# EAGLE design dsPIC_I2CMini (EAGLE 7.2.0)
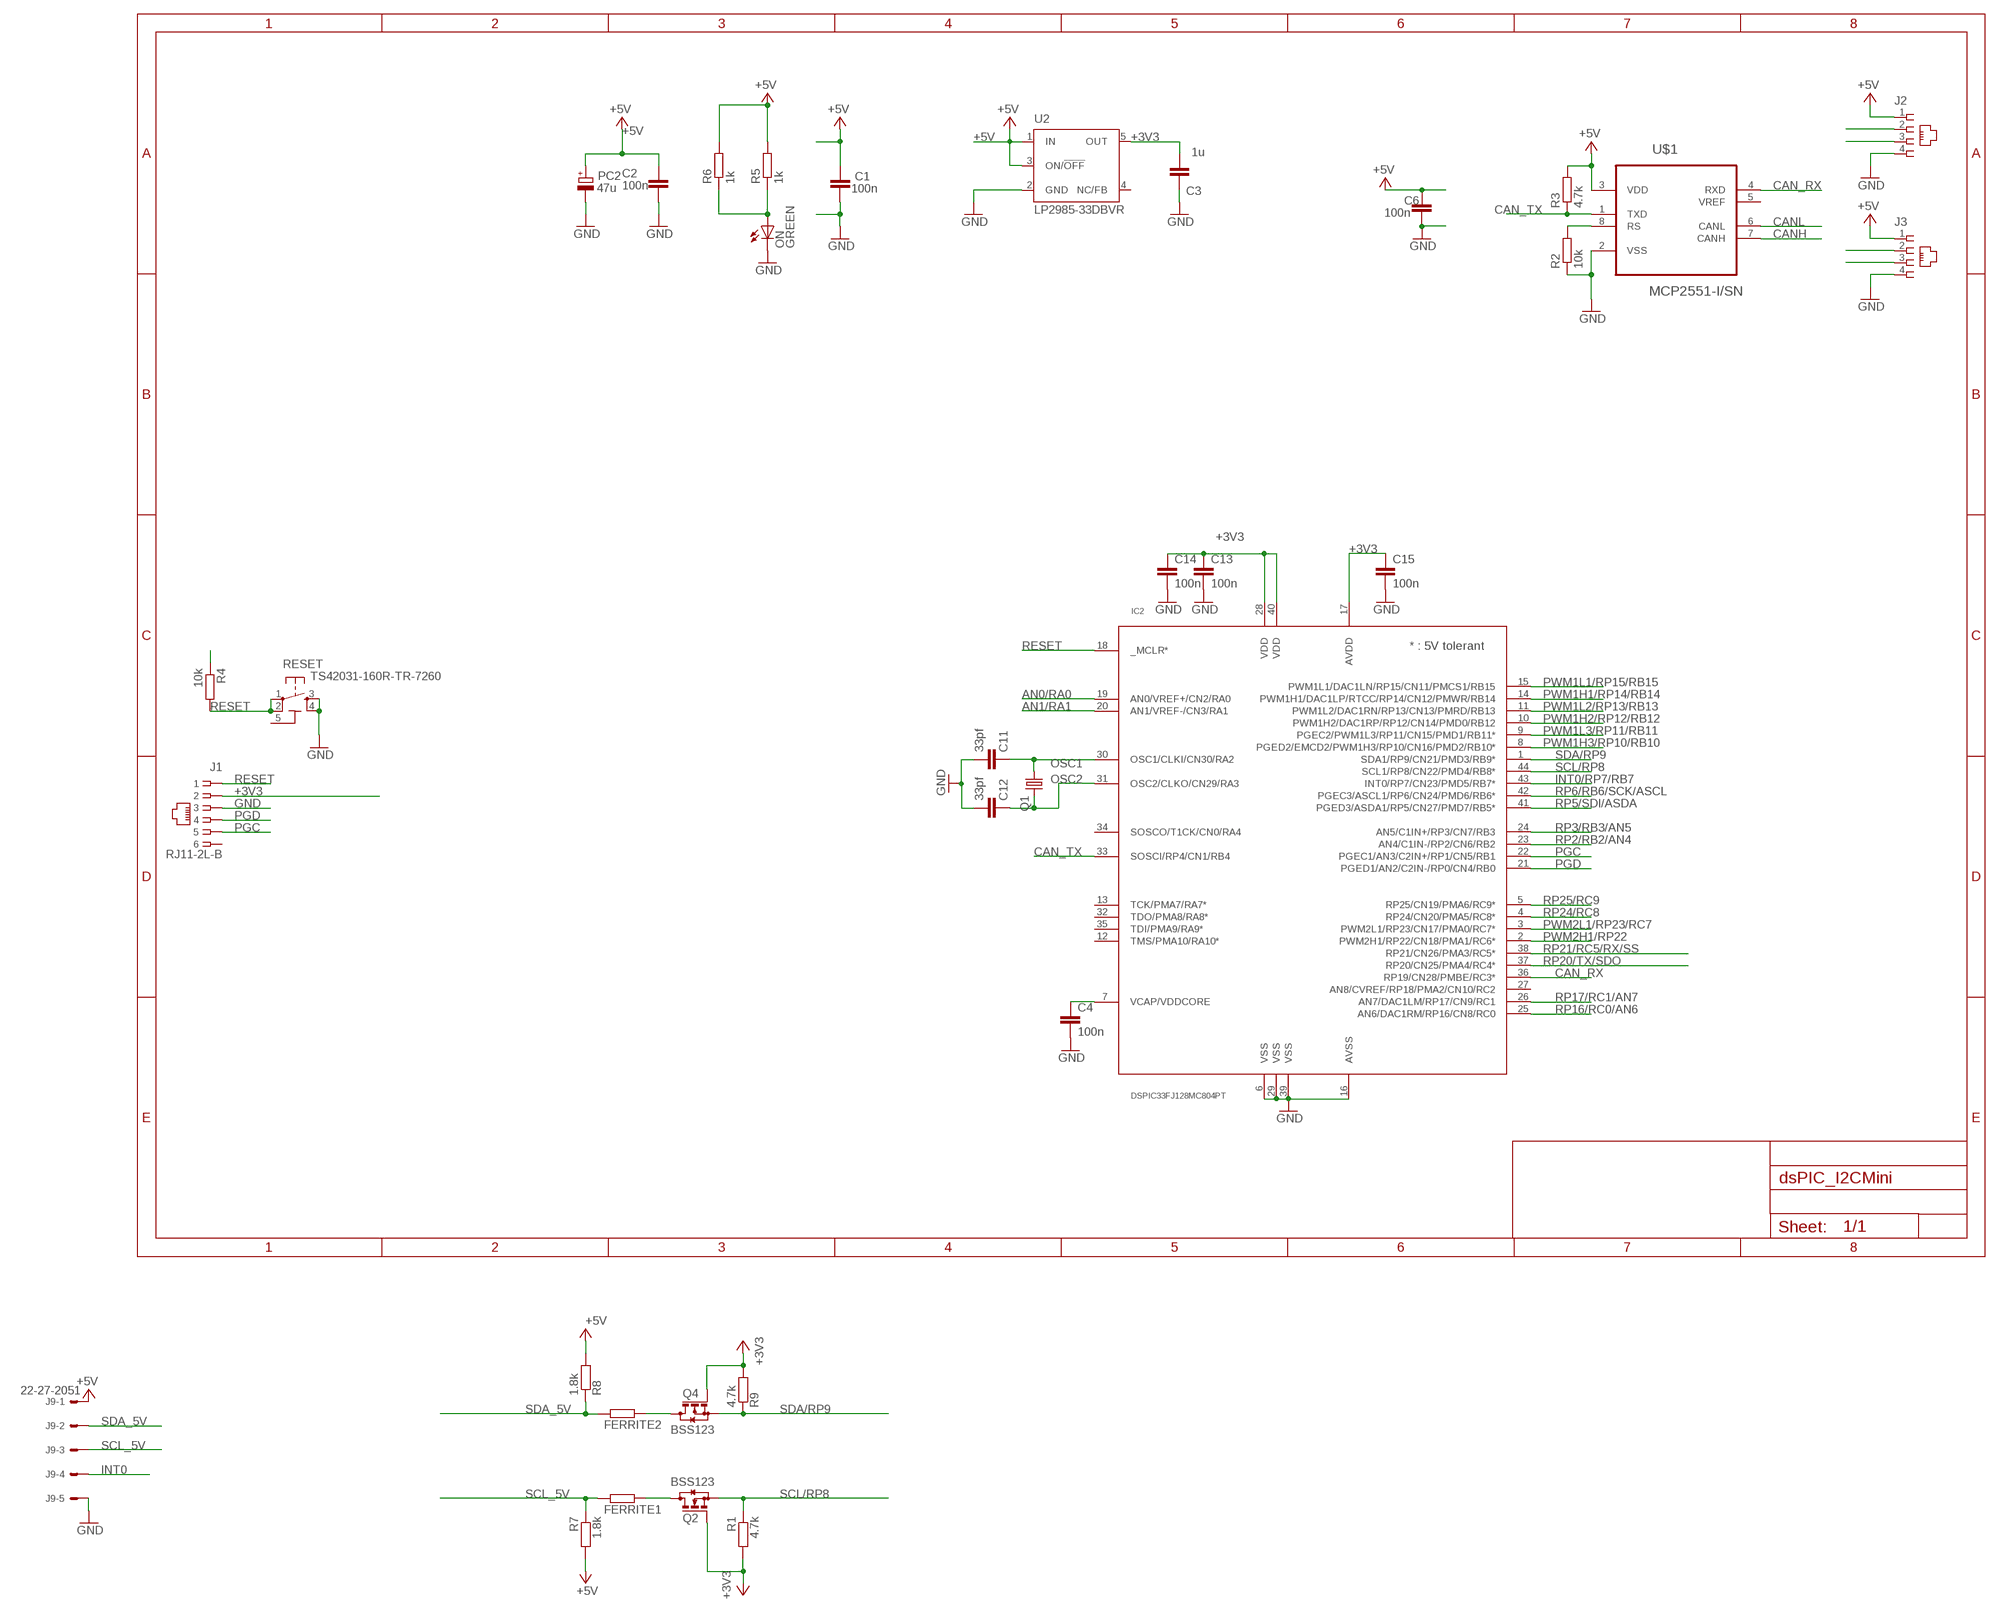
[diagram p0: schematic, sheet 1]

## Parts
C1  100n  C-EU0603-RND  [C0603-ROUND]
C2  100n  C-EU0603-RND  [C0603-ROUND]
C3  1u  C-EU0603-RND  [C0603-ROUND]
C4  100n  C-EUC0603K  [C0603K]
C6  100n  C-EUC0603K  [C0603K]
C11  33pf  C-EUC0603  [C0603]
C12  33pf  C-EUC0603  [C0603]
C13  100n  C-EUC0603  [C0603]
C14  100n  C-EUC0603  [C0603]
C15  100n  C-EUC0603  [C0603]
FERRITE1  R-EU_M0805  [M0805]
FERRITE2  R-EU_M0805  [M0805]
IC2  DSPIC33FJ128MC804PT  [TQFP44]
J1  RJ11-2L-B  [RJ11-NO_SHIELD]
J2  520249-2  [520249-2]
J3  520249-2  [520249-2]
J9  22-27-2051  22-27-2051-05  [6410-05]
ON  GREEN  LEDCHIP-LED0805  [CHIP-LED0805]
PC2  47u  CPOL-EUD  [PANASONIC_D]
Q1  CRYSTALSM49  [SM49]
Q2  BSS123  [SOT23]
Q4  BSS123  [SOT23]
R1  4.7k  R-EU_R0805  [R0805]
R2  10k  R-EU_R0805  [R0805]
R3  4.7k  R-EU_R0805  [R0805]
R4  10k  R-EU_R0805  [R0805]
R5  1k  R-EU_R0805  [R0805]
R6  1k  R-EU_R0805  [R0805]
R7  1.8k  R-EU_R0805  [R0805]
R8  1.8k  R-EU_R0805  [R0805]
R9  4.7k  R-EU_R0805  [R0805]
RESET  TS42031-160R-TR-7260  TS42  [TS42]
U2  LP2985-33DBVR  LP2985-XXDBVR33  [SOT23-DBV]
U$1  MCP2551-I/SN  [SOIC127P600X175-8N]

## Nets
+3V3: C3.2 C13.1 C14.1 C15.1 IC2.17(AVDD) IC2.28(VDD) IC2.40(VDD) J1.2 Q2.1(G) Q4.1(G) R1.2 R4.1 R9.2 U2.5(OUT)
+5V: C1.2 C2.2 C6.2 J2.1 J3.1 J9.1 PC2.+ R3.2 R5.2 R6.2 R7.2 R8.2 U2.1(IN) U2.3(ON/!OFF) U$1.3(VDD)
AN0/RA0: IC2.19(AN0/VREF+/CN2/RA0)
AN1/RA1: IC2.20(AN1/VREF-/CN3/RA1)
ASCL: FERRITE1.2 Q2.3(D)
ASDA: FERRITE2.2 Q4.3(D)
CAN_RX: IC2.36(RP19/CN28/PMBE/RC3*) U$1.4(RXD)
CAN_TX: IC2.33(SOSCI/RP4/CN1/RB4) R3.1 U$1.1(TXD)
CANH: J2.2 J3.2 U$1.7(CANH)
CANL: J2.3 J3.3 U$1.6(CANL)
GND: C1.1 C2.1 C3.1 C4.2 C6.1 C11.2 C12.2 C13.2 C14.2 C15.2 IC2.6(VSS) IC2.16(AVSS) IC2.29(VSS) IC2.39(VSS) J1.3 J2.4 J3.4 J9.5 ON.C PC2.- R2.1 RESET.3 RESET.4 U2.2(GND) U$1.2(VSS)
INT0: J9.4
INT0/RP7/RB7: IC2.43(INT0/RP7/CN23/PMD5/RB7*)
N$3: ON.A R5.1 R6.1
N$5: C4.1 IC2.7(VCAP/VDDCORE)
N$11: R2.2 U$1.8(RS)
OSC1: C11.1 IC2.30(OSC1/CLKI/CN30/RA2) Q1.1
OSC2: C12.1 IC2.31(OSC2/CLKO/CN29/RA3) Q1.2
PGC: IC2.22(PGEC1/AN3/C2IN+/RP1/CN5/RB1) J1.5
PGD: IC2.21(PGED1/AN2/C2IN-/RP0/CN4/RB0) J1.4
PWM1H1/RP14/RB14: IC2.14(PWM1H1/DAC1LP/RTCC/RP14/CN12/PMWR/RB14)
PWM1H2/RP12/RB12: IC2.10(PWM1H2/DAC1RP/RP12/CN14/PMD0/RB12)
PWM1H3/RP10/RB10: IC2.8(PGED2/EMCD2/PWM1H3/RP10/CN16/PMD2/RB10*)
PWM1L1/RP15/RB15: IC2.15(PWM1L1/DAC1LN/RP15/CN11/PMCS1/RB15)
PWM1L2/RP13/RB13: IC2.11(PWM1L2/DAC1RN/RP13/CN13/PMRD/RB13)
PWM1L3/RP11/RB11: IC2.9(PGEC2/PWM1L3/RP11/CN15/PMD1/RB11*)
PWM2H1/RP22: IC2.2(PWM2H1/RP22/CN18/PMA1/RC6*)
PWM2L1/RP23/RC7: IC2.3(PWM2L1/RP23/CN17/PMA0/RC7*)
RESET: IC2.18(_MCLR*) J1.1 R4.2 RESET.1 RESET.2
RP2/RB2/AN4: IC2.23(AN4/C1IN-/RP2/CN6/RB2)
RP3/RB3/AN5: IC2.24(AN5/C1IN+/RP3/CN7/RB3)
RP5/SDI/ASDA: IC2.41(PGED3/ASDA1/RP5/CN27/PMD7/RB5*)
RP6/RB6/SCK/ASCL: IC2.42(PGEC3/ASCL1/RP6/CN24/PMD6/RB6*)
RP16/RC0/AN6: IC2.25(AN6/DAC1RM/RP16/CN8/RC0)
RP17/RC1/AN7: IC2.26(AN7/DAC1LM/RP17/CN9/RC1)
RP20/TX/SDO: IC2.37(RP20/CN25/PMA4/RC4*)
RP21/RC5/RX/SS: IC2.38(RP21/CN26/PMA3/RC5*)
RP24/RC8: IC2.4(RP24/CN20/PMA5/RC8*)
RP25/RC9: IC2.5(RP25/CN19/PMA6/RC9*)
SCL/RP8: IC2.44(SCL1/RP8/CN22/PMD4/RB8*) Q2.2(S) R1.1
SCL_5V: FERRITE1.1 J9.3 R7.1
SDA/RP9: IC2.1(SDA1/RP9/CN21/PMD3/RB9*) Q4.2(S) R9.1
SDA_5V: FERRITE2.1 J9.2 R8.1
Unconnected: IC2.12(TMS/PMA10/RA10*) IC2.13(TCK/PMA7/RA7*) IC2.27(AN8/CVREF/RP18/PMA2/CN10/RC2) IC2.32(TDO/PMA8/RA8*) IC2.34(SOSCO/T1CK/CN0/RA4) IC2.35(TDI/PMA9/RA9*) J1.6 U2.4(NC/FB) U$1.5(VREF)

## Power pins joined to a net without a drawn wire
5-GND: RESET.5(5-GND)

## Library data of the parts
C1 C2 C4 C6 = SmartPrj:C-EU: CAPACITOR, European symbol; OC_FARNELL: 2210925
C3 = SmartPrj:C-EU: CAPACITOR, European symbol; OC_FARNELL: 2346901
C11 C12 = LibPerso:C-EU: CAPACITOR, European symbol; OC_FARNELL: 1740598
C13-C15 = LibPerso:C-EU: CAPACITOR, European symbol; OC_FARNELL: 2210925
FERRITE1 FERRITE2 = LibPerso:R-EU_: RESISTOR, European symbol; OC_FARNELL: 2292459
IC2 = microchip-dspic33:DSPIC33F*04
J1 = LibPerso:RJ11: CORCOM Modular RJ Jacks No Shield Source: www.tycoelectronics.com .. ENG_DS_1654001_1099_RJ_L_0507.pdf; MF: TYCO ELECTRONICS; MPN: RJ11-2L-B; OC_FARNELL: 1393306; OC_NEWARK: 83F4463
J2 J3 = LibPerso:520249-2: AMP connector; OC_FARNELL: 1137972; OC_RS: 477-359
J9 = con-molex:22-?-05: CONNECTOR wire to board 2.54 mm (.1 inch) pitch header; OC_FARNELL: unknown; OC_NEWARK: unknown
ON = led:LED: LED OSRAM: - CHIPLED LG R971, LG N971, LY N971, LG Q971, LY Q971, LO R971, LY R971 LH N974, LH R974 LS Q976, LO Q976, LY Q976 LO Q996 - Hyper CHIPLED LW Q18S LB Q993, LB Q99A, LB R99A - SideLED LS A670, LO A670, LY A670, LG A670, LP A670 LB A673, LV A673, LT A673, LW A673 LH A674 LY A675 LS A676, LA A676, LO A676, LY A676, LW A676 LS A679, LY A679, LG A679 - Hyper Micro SIDELED® LS Y876, LA Y876, LO Y876, LY Y876 LT Y87S - SmartLED LW L88C, LW L88S LB L89C, LB L89S, LG L890 LS L89K, LO L89K, LY L89K LS L896, LA L896, LO L896, LY L896 - TOPLED LS T670, LO T670, LY T670, LG T670, LP T670 LSG T670, LSP T670, LSY T670, LOP T670, LYG T670 LG T671, LOG T671, LSG T671 LB T673, LV T673, LT T673, LW T673 LH T674 LS T676, LA T676, LO T676, LY T676, LB T676, LH T676, LSB T676, LW T676 LB T67C, LV T67C, LT T67C, LS T67K, LO T67K, LY T67K, LW E67C LS E67B, LA E67B, LO E67B, LY E67B, LB E67C, LV E67C, LT E67C LW T67C LS T679, LY T679, LG T679 LS T770, LO T770, LY T770, LG T770, LP T770 LB T773, LV T773, LT T773, LW T773 LH T774 LS E675, LA E675, LY E675, LS T675 LS T776, LA T776, LO T776, LY T776, LB T776 LHGB T686 LT T68C, LB T68C - Hyper Mini TOPLED® LB M676 - Mini TOPLED Santana® LG M470 LS M47K, LO M47K, LY M47K Source: http://www.osram.convergy.de LUXEON: - LUMILED® LXK2-PW12-R00, LXK2-PW12-S00, LXK2-PW14-U00, LXK2-PW14-V00 LXK2-PM12-R00, LXK2-PM12-S00, LXK2-PM14-U00 LXK2-PE12-Q00, LXK2-PE12-R00, LXK2-PE12-S00, LXK2-PE14-T00, LXK2-PE14-U00 LXK2-PB12-K00, LXK2-PB12-L00, LXK2-PB12-M00, LXK2-PB14-N00, LXK2-PB14-P00, LXK2-PB14-Q00 LXK2-PR12-L00, LXK2-PR12-M00, LXK2-PR14-Q00, LXK2-PR14-R00 LXK2-PD12-Q00, LXK2-PD12-R00, LXK2-PD12-S00 LXK2-PH12-R00, LXK2-PH12-S00 LXK2-PL12-P00, LXK2-PL12-Q00, LXK2-PL12-R00 Source: www.luxeon.com KINGBRIGHT: KA-3528ASYC Source: www.kingbright.com; OC_FARNELL: 8529906
PC2 = rcl:CPOL-EU: POLARIZED CAPACITOR, European symbol; OC_FARNELL: 1850100
Q1 = crystal:CRYSTAL: CRYSTAL; OC_FARNELL: 1842332; OC_NEWARK: unknown
Q2 Q4 = transistor-small-signal:BSS123: N-CHANNEL MOS FET
R1 R7-R9 = rcl:R-EU_: RESISTOR, European symbol
R2-R6 = LibPerso:R-EU_: RESISTOR, European symbol
RESET = SmartPrj:TS42: TS42 Dongnan Electronics Tact switch VDC 12V - 50mA; OC_FARNELL: 2060823
U2 = SmartPrj:LP2985-XXDBVR: ULTRALOW-POWER 50-mA LOW-DROPOUT LINEAR REGULATORS 50-mA Low-Dropout Regulator Source: http://focus.ti.com/lit/ds/symlink/tps77001.pdf; OC_FARNELL: 2395925
U$1 = LibPerso:MCP2551-I/SN: High-Speed CAN Transceiver; MPN: MCP2551-I/SN; OC_FARNELL: 9758569; OC_NEWARK: 69K7604; PACKAGE: SOIC-8; SUPPLIER: Microchip

## Net classes
0 default: width 0.254 mm, clearance 0.254 mm
1 power: width 0.61 mm, drill 0.61 mm, clearance 0.254 mm
2 gnd: width 0.305 mm, drill 0.559 mm, clearance 0.254 mm
3 usbvcc: width 0.508 mm, drill 0.61 mm, clearance 0.254 mm
4 aref: width 0.406 mm, drill 0.61 mm, clearance 0.254 mm

## Board
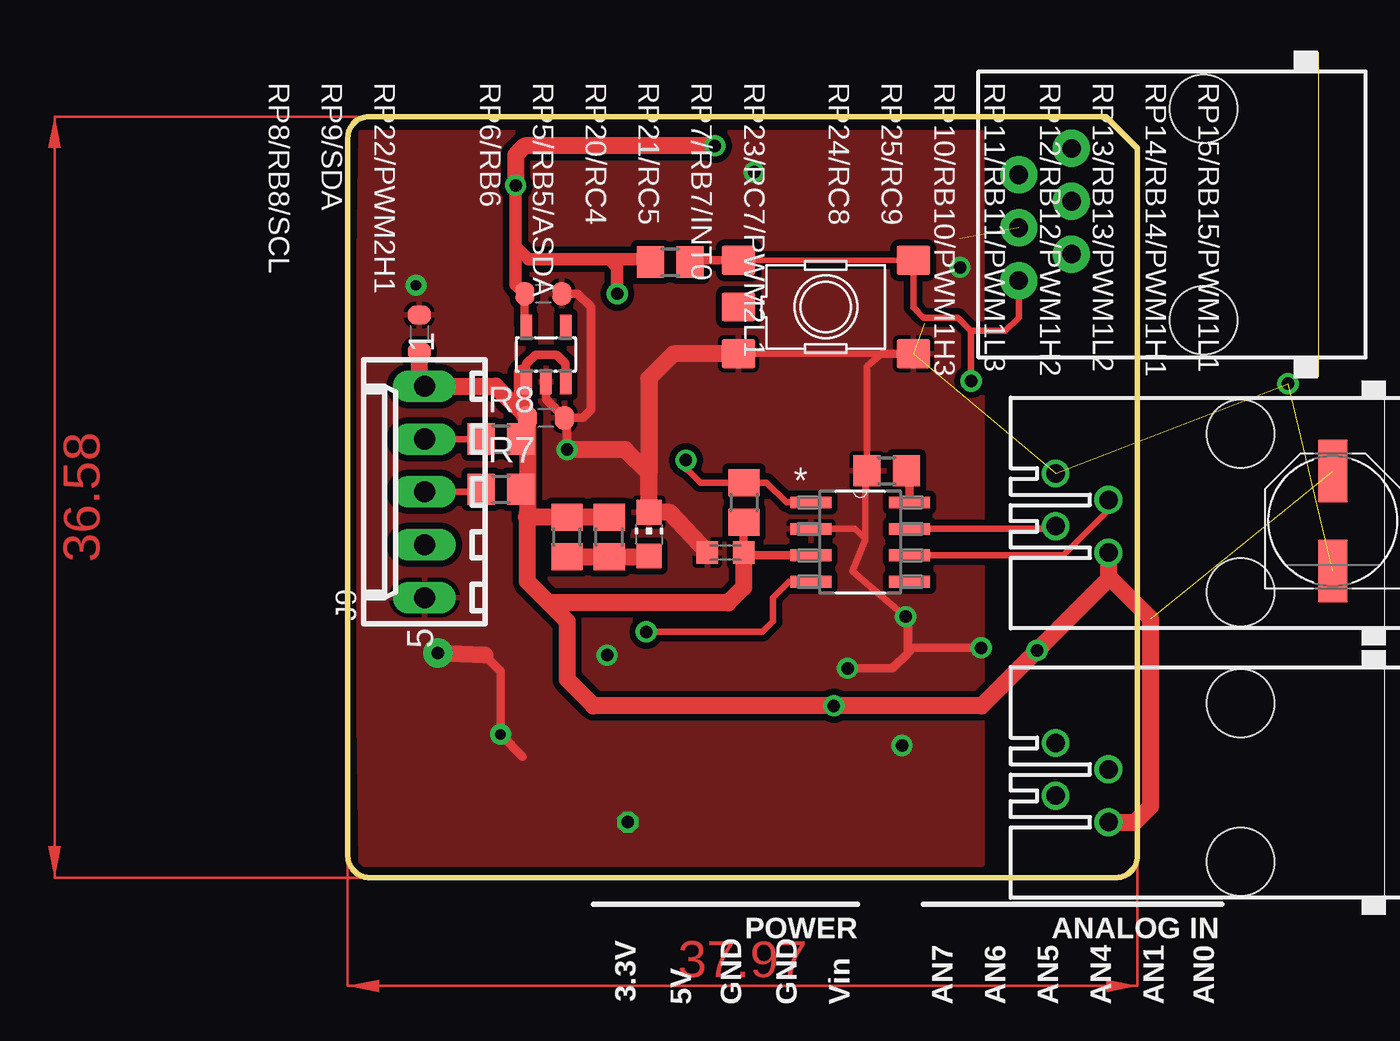
[diagram p1: board, top side]
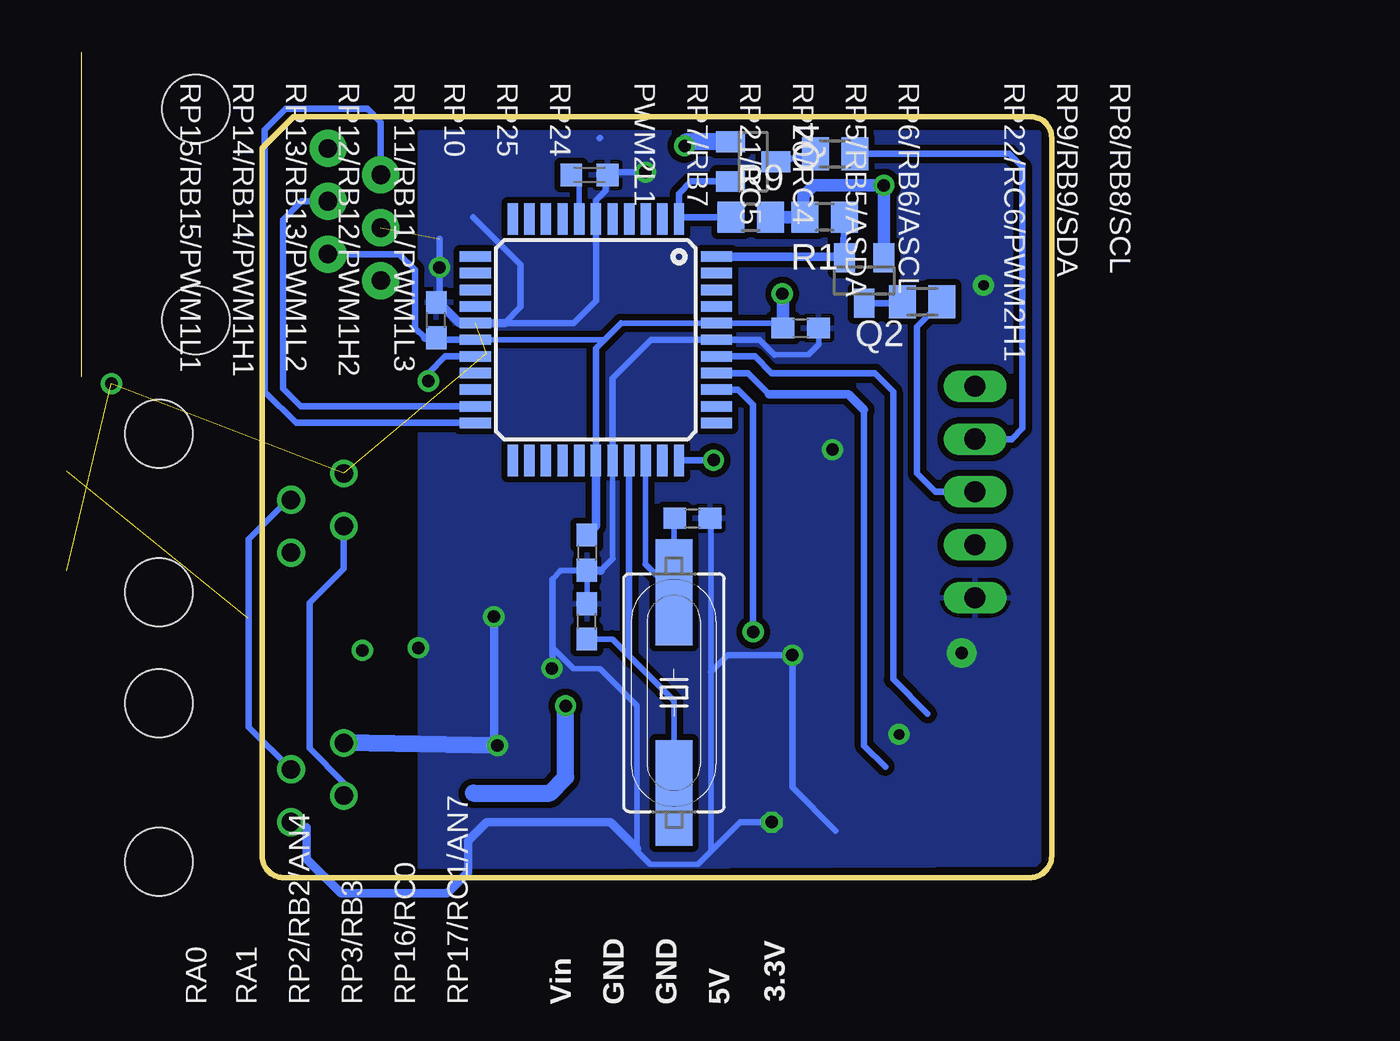
[diagram p2: board, bottom side, seen from below]

Size 37.98 x 36.58 mm. Coordinates in mm from the lower left corner, seen from the top.
Outline: 36.45,36.58 37.97,35.05 37.97,1.13 arc-90 36.97,0 1,0 arc-90 0,1.13 0,35.58 arc-90 1,36.58 36.45,36.58
Copper layers (1*16): Top 0.018mm / dielectric 1.55mm / Bottom 0.018mm
Design rules "eC_2Layer_PClass6_BaseCopperO18_eCDefault": minimum track width 0.15mm, minimum drill 0.35mm, track to track 0.15mm, track to pad 0.15mm, pad to pad 0.15mm, via to via 0.15mm, smd to smd 0mil, copper to edge 0.25mm, drill to drill 0.35mm, minimum pad ring 0.175mm, minimum via ring 0.125mm, stop-mask expansion 0mil, vias tented up to drill 0.45mm, thermal gap 0.2mm
Holes 3.2 mm at 55.25,32.38 56.52,27.18 55.25,36.45 56.52,20.7
vRestrict: area 26.7,-0.8 to 27.3,-0.3; area 29.2,-0.9 to 29.7,0

### Footprints (pad centres in the part's own frame; a part is rotated, then mirrored left to right if it is on the bottom)
C0603-ROUND = smd 0.898 x 1.1: 1 -0.889,0; 2 0.889,0
C0603K = smd 1.05 x 1.08: 1 -0.875,0; 2 0.875,0
C0603 = smd 1.1 x 1: 1 -0.85,0; 2 0.85,0
M0805 = smd 1.3 x 1.6: 1 -0.95,0; 2 0.95,0
TQFP44 = smd 1.5 x 0.5: 1 -5.8,4; 2 -5.8,3.2; 3 -5.8,2.4; 4 -5.8,1.6; 5 -5.8,0.8; 6 -5.8,0; 7 -5.8,-0.8; 8 -5.8,-1.6; 9 -5.8,-2.4; 10 -5.8,-3.2; 11 -5.8,-4; 23 5.8,-4; 24 5.8,-3.2; 25 5.8,-2.4; 26 5.8,-1.6; 27 5.8,-0.8; 28 5.8,0; 29 5.8,0.8; 30 5.8,1.6; 31 5.8,2.4; 32 5.8,3.2; 33 5.8,4 | smd 0.5 x 1.5: 12 -4,-5.8; 13 -3.2,-5.8; 14 -2.4,-5.8; 15 -1.6,-5.8; 16 -0.8,-5.8; 17 0,-5.8; 18 0.8,-5.8; 19 1.6,-5.8; 20 2.4,-5.8; 21 3.2,-5.8; 22 4,-5.8; 34 4,5.8; 35 3.2,5.8; 36 2.4,5.8; 37 1.6,5.8; 38 0.8,5.8; 39 0,5.8; 40 -0.8,5.8; 41 -1.6,5.8; 42 -2.4,5.8; 43 -3.2,5.8; 44 -4,5.8
RJ11-NO_SHIELD = drill 0.9 pad 1.778: 1 -3.175,8.89; 2 -1.905,6.35; 3 -0.635,8.89; 4 0.635,6.35; 5 1.905,8.89; 6 3.175,6.35 | hole 3.251: -5.08,0; 5.08,0
520249-2 = drill 0.889: 1 -1.905,6.35; 2 -0.635,8.89; 3 0.635,6.35; 4 1.905,8.89 | hole 3.251: -3.81,0; 3.81,0
6410-05 = drill 1.016 long: 1 5.08,0; 2 2.54,0; 3 0,0; 4 -2.54,0; 5 -5.08,0
CHIP-LED0805 = smd 1.2 x 1.2: A 0,-1.05; C 0,1.05
PANASONIC_D = smd 3 x 1.4: + 2.4,0; - -2.4,0
SM49 = smd 5.08 x 1.778: 1 -4.826,0; 2 4.826,0
SOT23 = smd 1 x 1.4: 1 -0.95,-1.1; 2 0.95,-1.1; 3 0,1.1
R0805 = smd 1.3 x 1.5: 1 -0.95,0; 2 0.95,0
TS42 = smd 1.6 x 1.4: 1 -4.2,2.25; 2 4.2,2.25; 3 -4.2,-2.25; 4 4.2,-2.25; 5 -4.2,0
SOT23-DBV = smd 0.55 x 1.2: 1 -0.95,-1.3; 2 0,-1.3; 3 0.95,-1.3; 4 0.95,1.3; 5 -0.95,1.3
SOIC127P600X175-8N = smd 1.981 x 0.559: 1 -2.362,1.905; 2 -2.362,0.635; 3 -2.362,-0.635; 4 -2.362,-1.905; 5 2.362,-1.905; 6 2.362,-0.635; 7 2.362,0.635; 8 2.362,1.905

### Placement (x,y rotation side)
C1  9.53,22.1 180 top
C2  3.43,26.16 270 top
C3  9.4,28.07 180 top
C4  22.23,33.78 0 bottom
C6  18.16,15.62 0 top
C11  22.35,12.32 90 bottom
C12  17.27,17.27 0 bottom
C13  12.07,26.42 0 bottom
C14  22.35,15.62 270 bottom
C15  29.59,26.8 90 bottom
FERRITE1  6.22,27.69 180 bottom
FERRITE2  10.42,34.8 180 bottom
IC2  21.92,25.86 270 bottom
J1  41.15,31.88 90 top
J2  42.93,17.53 90 top
J3  42.93,4.57 90 top
J9  3.68,18.54 90 top
ON  14.48,16.51 0 top
PC2  47.37,17.14 90 top  (outside the outline)
Q1  18.16,8.89 90 bottom
Q2  9.02,28.7 180 bottom
Q4  14.35,34.42 270 bottom
R1  10.92,31.75 180 bottom
R2  25.91,19.56 0 top
R3  19.05,18.03 270 top
R4  15.5,29.59 0 top
R5  12.57,16.38 90 top
R6  10.54,16.38 90 top
R7  7.37,18.67 0 top
R8  7.37,21.08 0 top
R9  14.48,31.75 0 bottom
RESET  22.99,27.43 0 top
U2  9.53,25.15 0 top
U$1  24.64,16.13 0 top

### Tracks (layer width: path | path; a pad name or v marks a point on that pad's centre or on a via)
+3V3  (via drill 0.6 pad 1.02)
  Top 0.406: U2.5 8.51,26.51 C3.2
  Top 0.61: C3.2 8.07,28.51 8.07,30.35 | 8.07,30.35 v8.07,33.27 | v12.96,28.07 12.96,29.34 12.57,29.72 | 12.57,29.72 8.7,29.72 8.07,30.35 | R4.1 14.42,29.72 12.57,29.72
  Top 0.813: v17.65,35.18 8.51,35.18 8.07,34.74 v8.07,33.27
  Bottom 0.254: C13.1 13.18,26.66 IC2.40 20.72,26.66 21.52,25.86 IC2.17
  Bottom 0.305: IC2.17 29.75,25.86 C15.1 | 30.14,25.95 30.61,26.42 30.61,29.21 31.37,29.97 J1.2 | IC2.28 21.92,25.45 20.72,26.66
  Bottom 0.406: C15.1 30.14,25.95 | C14.1 21.92,16.91 IC2.28
  Bottom 0.61: C13.1 12.92,28.03 v12.96,28.07 | Q2.1 v8.07,33.27 11.43,33.27 11.94,32.77 11.94,31.82 R1.2 R9.2
  Bottom 0.813: Q4.1 17.59,35.37 v17.65,35.18
+5V  (via drill 0.6 pad 1.02)  (1 unrouted)
  Top 0.406: U2.1 8.58,24.7 9.02,25.15 10.03,25.15 10.48,24.7 U2.3 | U2.1 8.64,23.79 | R3.2 19.04,17.07 C6.2 19.16,15.49 U$1.3 | U2.1 8.58,24.06 8.38,24.26
  Top 0.813: C1.2 8.64,18.35 | 8.64,17.4 8.64,17.53 8.64,18.35 | 8.64,17.4 8.57,17.33 R5.2 R6.2 | C6.2 19.04,13.96 18.29,13.21 9.65,13.21 | 9.65,13.21 8.64,14.22 8.64,17.4 | 9.65,13.21 10.54,12.32 10.54,9.53 11.81,8.25 v23.37,8.25 30.48,8.25 v33.15,10.92 36.58,14.35 36.58,14.48 | 8.38,24.26 8.38,22.35 C1.2 | J2.1 36.58,14.48 | J3.1 37.85,2.67 38.61,3.43 38.61,12.45 36.58,14.48 | C2.2 3.43,23.88 J9.1 7.11,23.62 C1.2 | R8.2 8.64,21.4 C1.2 | R7.2 8.64,18.35
  Bottom 0.813: 27.81,4.06 24.13,4.06 23.37,4.83 v23.37,8.25
ASCL
  Bottom 0.305: Q2.3 7.26,27.6
  Bottom 0.406: 7.26,27.6 FERRITE1.2
ASDA
  Bottom 0.305: Q4.3 FERRITE2.2
CAN_RX  (via drill 0.6 pad 1.02)
  Top 0.305: v14.35,11.81 19.94,11.81 20.45,12.32 20.45,13.46 21.21,14.22 U$1.4
  Bottom 0.305: IC2.36 15.07,23.45 14.35,22.73 v14.35,11.81
CAN_TX  (via drill 0.6 pad 1.02)
  Top 0.305: 16.26,19.69 16.96,18.98 R3.1 20.13,18.98 21.08,18.03 U$1.1
  Top 0.406: 16.26,19.69 v16.26,20.07
  Bottom 0.305: IC2.33 v16.26,20.05
  Bottom 0.406: v16.26,20.05 v16.26,20.07
CANH
  Top 0.305: U$1.7 33.91,16.76 J2.2
  Bottom 0.305: J3.2 34.04,4.57 35.69,6.22 35.69,13.21 34.04,14.86 J2.2
CANL
  Top 0.305: U$1.6 34.42,15.49 36.58,17.65 J2.3
  Bottom 0.305: J3.3 38.61,7.24 38.61,16.26 36.7,18.16 J2.3
GND  (via drill 0.5 pad 1.02, 0.6 pad 1.02, 0.6 pad 1.42)  (5 unrouted)
  Top 0.305: U$1.2 24.39,16.76 24.89,16.26 | 24.89,16.26 24.26,14.73 v26.82,12.55 | 24.89,19.37 24.89,16.26 | 25.69,25.18 24.96,24.58 R2.1 | RESET.3 RESET.4
  Top 0.406: C3.1 11.05,28.07 11.69,27.43 11.69,22.48 11.3,22.1 C1.1 | U2.2 9.53,22.99 C1.1 | R2.1 24.89,19.37 | RESET.4 25.69,25.18 | v10.54,20.57 10.54,21.97 C1.1 | 6.58,10.69 7.34,9.93 v7.34,6.88 8.41,5.82 | v24.03,10.06 26.19,10.06 26.93,10.8 | 26.93,10.8 26.93,12.45 v26.82,12.55 | v30.46,11.05 27.18,11.05 26.93,10.8
  Top 0.813: C6.1 15.48,17.56 ON.C 14.48,19.43 | 14.48,19.43 13.34,20.57 v10.54,20.57 | RESET.3 15.66,25.18 14.48,24 14.48,19.43 | 6.58,10.69 v4.32,10.8
  Bottom 0.254: 21.12,15.33 21.12,19.56 IC2.29 | 23.61,14.75 24,14.35 | 24,13.97 24,11.05 22.99,10.03 21.72,10.03 19.94,8.25 19.94,1.4 19.94,1.27 19.31,0.63 17.02,0.63 16.38,1.27 16.38,9.91 16.38,17.23 | C14.2 C11.2 | 13.34,25.15 11.69,25.15 11.19,25.64 C13.2
  Bottom 0.305: 21.7,14.75 21.12,15.33 | C14.2 23.61,14.75 | 24,14.35 24,13.97 24,10.08 v24.03,10.06 | 13.34,25.15 14.05,25.86 IC2.39 19.27,25.86 21.12,24 21.12,19.56 | 28.47,26.66 IC2.16 23,26.66 21.92,27.74 IC2.6 21.92,32.56 21.46,33.02 21.46,33.67 | 21.72,35.56 21.73,35.55 | 16.38,9.91 15.6,10.69 v12.47,10.69 12.47,4.34 10.39,2.26 | 27.81,31.75 25.53,29.46 25.53,27.43 26.31,26.66 | 29.44,27.65 v29.44,29.34 29.44,30.71 | 16.38,1.27 14.99,2.67 v13.46,2.67 | v19.53,33.91 21.22,33.91
  Bottom 0.406: 16.38,17.23 C12.2 | C14.2 21.7,14.75 | IC2.16 26.31,26.66 | C15.2 29.44,27.65 29.44,27.62 28.47,26.66 | v26.65,6.35 26.82,6.53 v26.82,12.55 | 35.82,2.41 35.82,0.89 34.16,-0.76 29.08,-0.76 28.07,0.25 28.07,1.78 27.18,2.67 21.21,2.67 19.94,1.4 | 21.22,33.91 C4.2 21.46,33.67
  Bottom 0.813: v26.65,6.35 J3.4
  other vias: 45.21,23.75 3.28,28.47
  pour Bottom (isolate 0.305, rank 2): 0.64,35.81 30.35,35.81 30.35,0.51 0.64,0.63
  pour Top (isolate 0.305, rank 2): 0.64,35.81 30.48,35.81 30.48,0.63 0.64,0.63 0.38,19.69
N$3
  Top 0.813: R6.1 R5.1 14.45,15.43 ON.A
N$5
  Bottom 0.254: IC2.7 22.72,33.94 C4.1
N$11
  Top 0.406: R2.2 27,19.3 U$1.8
OSC1
  Bottom 0.254: Q1.1 18.16,8.51 20.32,10.67 21.12,11.47 C11.1
  Bottom 0.305: IC2.30 20.32,10.67
OSC2
  Bottom 0.254: C12.1 18.16,17.23 Q1.2 | IC2.31 19.52,15.07
  Bottom 0.305: 19.52,15.07 Q1.2
PGC
  Bottom 0.305: 32.76,21.86 IC2.22 36.33,21.86 37.85,23.37 37.85,35.94 36.83,36.96 32.89,36.96 32.26,36.32 J1.5
PGD
  Bottom 0.305: IC2.21 36.12,22.66 36.96,23.49 36.96,31.62 36.07,32.51 J1.4
RESET  (via drill 0.6 pad 1.02)
  Top 0.254: RESET.2 RESET.1
  Top 0.305: v29.97,23.88 29.97,26.29 | 29.97,26.29 29.34,26.92 27.69,26.92 27.19,27.42 RESET.2 | 29.97,26.29 31.62,26.29 32.26,26.92 J1.1
  Top 0.406: R4.2 16.54,29.68 RESET.1
  Bottom 0.305: IC2.18 29.18,25.05 29.97,24.26 v29.97,23.88
RP20/TX/SDO
  Bottom 0.305: 8,5.33 9.02,6.35 9.02,22.48 | 13.59,23.24 14.61,24.26 IC2.37
  Bottom 0.406: 9.02,22.48 9.78,23.24 13.59,23.24 | IC2.37
RP21/RC5/RX/SS
  Bottom 0.305: IC2.38 14.26,25.05 13.46,24.26 8.51,24.26 7.62,23.37 7.62,9.53 5.97,7.87
SCL/RP8
  Bottom 0.305: R1.1 10.03,29.87
  Bottom 0.406: IC2.44 10.02,29.86 Q2.2 10.03,29.87
SCL_5V
  Top 0.305: R7.1 6.29,18.54 J9.3
  Bottom 0.305: FERRITE1.1 6.48,26.48 6.48,19.43 5.59,18.54 J9.3
SDA/RP9
  Bottom 0.305: Q4.2 17.33,33.47 17.92,32.88 IC2.1 17.83,31.75 R9.1
SDA_5V
  Top 0.305: R8.1 J9.2
  Bottom 0.305: FERRITE2.1 2.03,34.8 1.4,34.16 1.4,21.59 1.91,21.08 J9.2
(copper drawn outside any net)
  shapes: Top area x2

### Text on the board
tNames: RP8/RB8/SCL | RP9/SDA | RP22/PWM2H1 | RP6/RB6 | RP5/RB5/ASDA | RP20/RC4 | RP21/RC5 | RP7/RB7/INT0 | RP23/RC7/PWM2L1 | RP24/RC8 | RP25/RC9 | RP10/RB10/PWM1H3 | RP11/RB11/PWM1L3 | RP12/RB12/PWM1H2 | RP13/RB13/PWM1L2 | RP14/RB14/PWM1H1 | RP15/RB15/PWM1L1 | POWER | ANALOG IN | 3.3V | 5V | GND | GND | Vin | AN7 | AN6 | AN5 | AN4 | AN1 | AN0
bNames: RP8/RB8/SCL | RP9/RB9/SDA | RP22/RC6/PWM2H1 | RP6/RB6/ASCL | RP5/RB5/ASDA | RP20/RC4 | RP21/RC5 | RP7/RB7 | PWM2L1 | RP24 | RP25 | RP10 | RP11/RB11/PWM1L3 | RP12/RB12/PWM1H2 | RP13/RB13/PWM1L2 | RP14/RB14/PWM1H1 | RP15/RB15/PWM1L1 | 3.3V | 5V | GND | GND | Vin | RP17/RC1/AN7 | RP16/RC0 | RP3/RB3 | RP2/RB2/AN4 | RA1 | RA0
214bmp: D:/SmartProjects/Snc/a4_bn_logo2.bmp